# Altium schematic sheet Sheet1.schdoc
size 172 x 83 mm
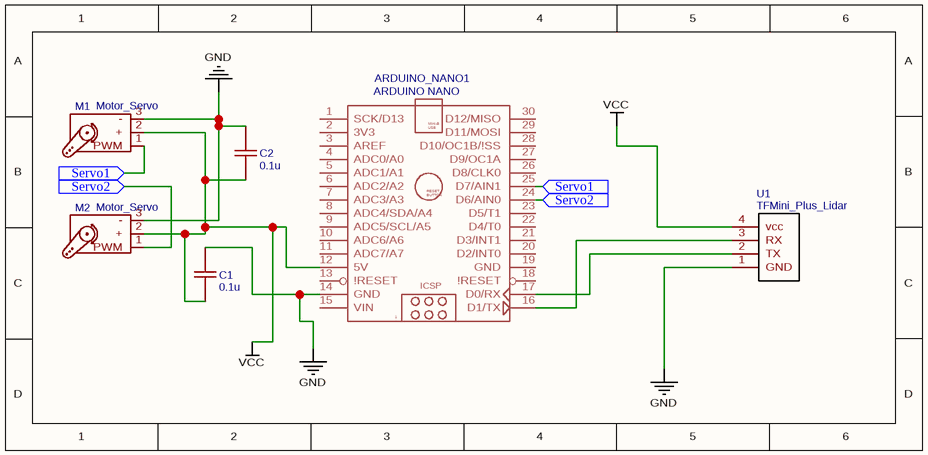
[diagram p0: Sheet1.schdoc]

## Parts
ARDUINO_NANO1  ARDUINO NANO  [ARDUINONANOV30_ARDUINO_NANO]
C1  0.1u  [C0603]
C2  0.1u  [C0603]
M1  Motor_Servo
M2  Motor_Servo
U1  TFMini_Plus_Lidar  [TFMINI_LIDAR]

## Ports
Servo1 (in), Servo2 (in)

## Nets
GND: ARDUINO_NANO1.14(GND) C1.2 C2.2 M1.3(-) M2.3(-) U1.1(GND)
VCC: ARDUINO_NANO1.12(5V) C1.1 C2.1 M1.2(+) M2.2(+) U1.4(vcc)
Servo1: ARDUINO_NANO1.25(D7/AIN1) M1.1(PWM) ; port Servo1
Servo2: ARDUINO_NANO1.24(D6/AIN0) M2.1(PWM) ; port Servo2
NetARDUINO_NANO1_16: ARDUINO_NANO1.16(D1/TX) U1.3(RX)
NetARDUINO_NANO1_17: ARDUINO_NANO1.17(D0/RX) U1.2(TX)

Not connected (* = marked no-connect by the designer): ARDUINO_NANO1 1(SCK/D13) 2(3V3) 3(AREF) 4(ADC0/A0) 5(ADC1/A1) 6(ADC2/A2) 7(ADC3/A3) 8(ADC4/SDA/A4) 9(ADC5/SCL/A5) 10(ADC6/A6) 11(ADC7/A7) 13(!RESET) 15(VIN) 18(!RESET) 19(GND) 20(D2/INT0) 21(D3/INT1) 22(D4/T0) 23(D5/T1) 26(D8/CLK0) 27(D9/OC1A) 28(D10/OC1B/!SS) 29(D11/MOSI) 30(D12/MISO)

## Notes on the sheet
- (in symbol ARDUINO NANO) Mini-B / USB; RESET / BUTTON; ICSP

## Library data of the parts
ARDUINO_NANO1 = ARDUINO NANO: Contributor: dhya; spicePre: A; spiceSymbolName: ARDUINO NANO
C1 C2 = 0.1u: nameAlias: Value(F); Contributor: LCEDA_Lib; spicePre: C; spiceSymbolName: C_0603_US
M1 M2 = Motor_Servo: Contributor: KiCAD; license: https://www.gnu.org/licenses/lgpl-2.1.html; spicePre: M; spiceSymbolName: Motor_Servo
U1 = TFMini_Plus_Lidar: Contributor: tiago.valadares; spicePre: U; spiceSymbolName: TFMini_Plus_Lidar